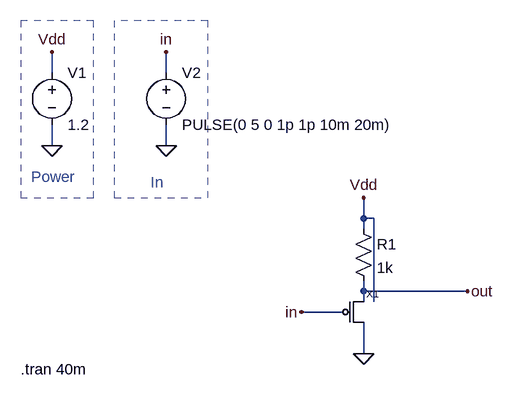
[diagram p0: schematic pmos_block.asc]
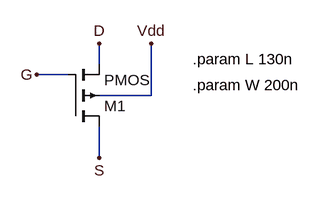
[diagram p1: sub-circuit pmos.asc]
pmos_block.asc, the LTspice schematic file:
Version 4
SHEET 1 880 680
WIRE -560 -416 -560 -448
WIRE -384 -416 -384 -448
WIRE -560 -304 -560 -336
WIRE -384 -304 -384 -336
WIRE -80 -192 -80 -224
WIRE -64 -192 -80 -192
WIRE -80 -176 -80 -192
WIRE -80 -80 -80 -96
WIRE 80 -80 -80 -80
WIRE -80 -64 -80 -80
WIRE -64 -64 -64 -192
WIRE -112 -48 -176 -48
WIRE -80 16 -80 -32
FLAG 80 -80 out
FLAG -176 -48 in
FLAG -80 -224 Vdd
FLAG -80 16 0
FLAG -560 -304 0
FLAG -560 -448 Vdd
FLAG -384 -304 0
FLAG -384 -448 in
SYMBOL voltage -560 -432 R0
WINDOW 123 0 0 Left 0
WINDOW 39 0 0 Left 0
SYMATTR InstName V1
SYMATTR Value 1.2
SYMBOL voltage -384 -432 R0
WINDOW 123 0 0 Left 0
WINDOW 39 0 0 Left 0
SYMATTR InstName V2
SYMATTR Value PULSE(0 5 0 1p 1p 10m 20m)
SYMBOL res -96 -192 R0
SYMATTR InstName R1
SYMATTR Value 1k
SYMBOL pmos -112 -48 R0
SYMATTR InstName X1
TEXT -592 -256 Left 2 ;Power
TEXT -408 -248 Left 2 ;In
TEXT -608 40 Left 2 !.tran 40m
RECTANGLE Normal -496 -496 -608 -224 2
RECTANGLE Normal -320 -496 -464 -224 2

pmos.asc, the sub-circuit schematic file:
Version 4
SHEET 1 880 680
WIRE -80 -96 -80 -128
WIRE -128 -80 -176 -80
WIRE 0 -48 0 -128
WIRE 0 -48 -80 -48
WIRE -80 48 -80 0
FLAG -176 -80 G
FLAG -80 48 S
FLAG -80 -128 D
FLAG 0 -128 Vdd
SYMBOL pmos4 -128 0 M180
SYMATTR InstName M1
SYMATTR Value2 l={L} w={W}
TEXT 64 -104 Left 2 !.param L 130n
TEXT 64 -64 Left 2 !.param W 200n

The netlist it stands for:
* pmos_block.asc
V1 Vdd 0 1.2
V2 in 0 PULSE(0 5 0 1p 1p 10m 20m)
R1 Vdd out 1k
XX1 in out 0 pmos

* block symbol definitions
.subckt pmos G D S
M1 S G D Vdd PMOS l={L} w={W}
.param L 130n
.param W 200n
.ends pmos

.model NMOS NMOS
.model PMOS PMOS
.lib standard.mos
* Power
* In
.tran 40m
.backanno
.end